# Altium schematic sheet MCU.SchDoc
size 355 x 203 mm; SheetNumber: 2; SheetTotal: 8
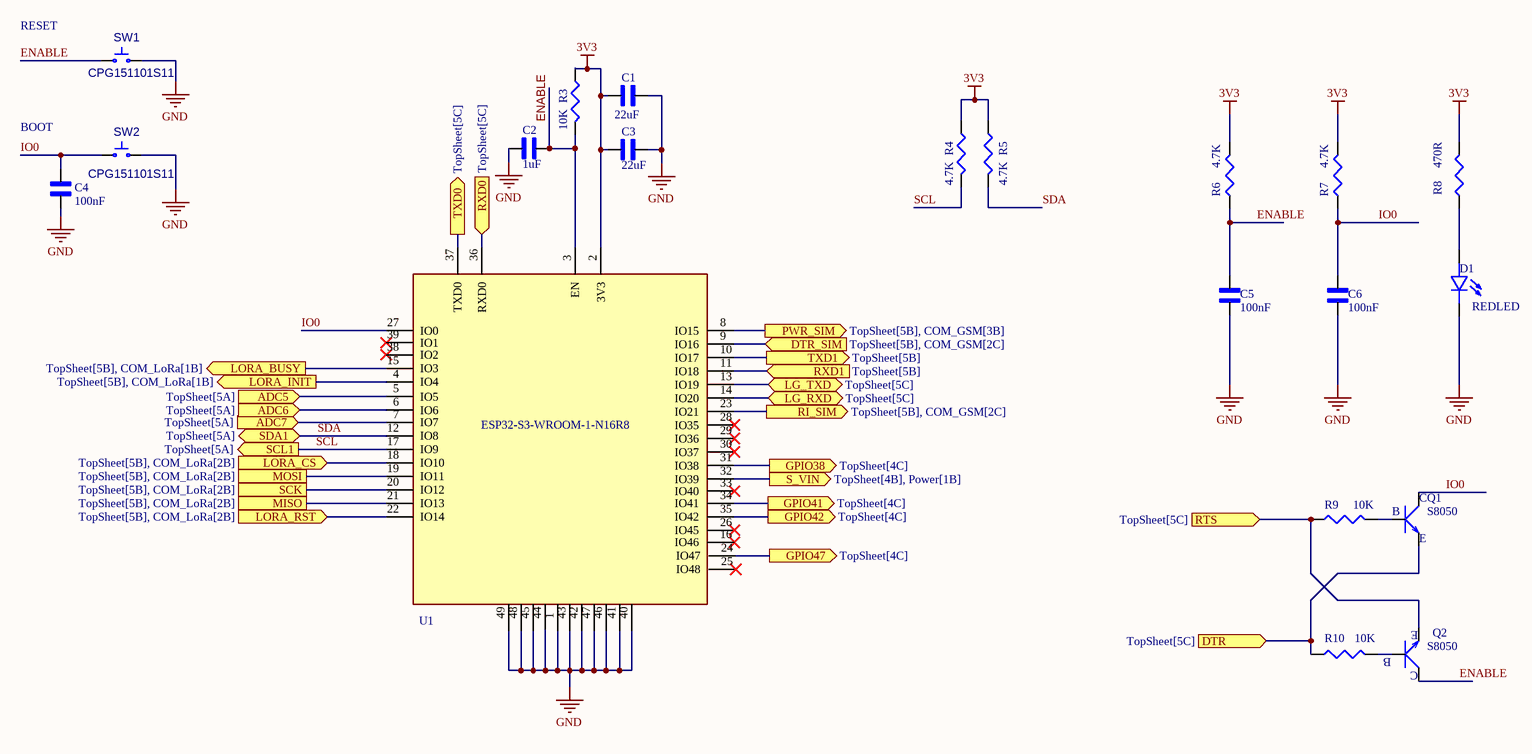
[diagram p0: MCU.SchDoc]

## Parts
C1  22uF  [C0603]
C2  1uF  [C0603]
C3  22uF  [C0603]
C4  100nF  [C0603]
C5  100nF  [C0603]
C6  100nF  [C0603]
D1  REDLED  [0603D-B]
Q1  S8050  [SOT95P237X112-3N]
Q2  S8050  [SOT95P237X112-3N]
R3  10K  [R0603]
R4  4.7K  [R0603]
R5  4.7K  [R0603]
R6  4.7K  [R0603]
R7  4.7K  [R0603]
R8  470R  [R0603]
R9  10K  [R0603]
R10  10K  [R0603]
SW1  CPG151101S11  [5.2 mm × 5.2 mm SW]
SW2  CPG151101S11  [5.2 mm × 5.2 mm SW]
U1  ESP32-S3-WROOM-1-N16R8  [ESP32S3WROOM1N8R2]

## Ports
ADC5 (in, see TopSheet[5A]), ADC6 (in, see TopSheet[5A]), ADC7 (in, see TopSheet[5A]), DTR (in, see TopSheet[5C]), DTR_SIM (in, see TopSheet[5B], COM_GSM[2C]), GPIO38 (out, see TopSheet[4C]), GPIO41 (out, see TopSheet[4C]), GPIO42 (out, see TopSheet[4C]), GPIO47 (out, see TopSheet[4C]), LG_RXD (bidir, see TopSheet[5C]), LG_TXD (bidir, see TopSheet[5C]), LORA_BUSY (out, see TopSheet[5B], COM_LoRa[1B]), LORA_CS (in, see TopSheet[5B], COM_LoRa[2B]), LORA_INIT (out, see TopSheet[5B], COM_LoRa[1B]), LORA_RST (in, see TopSheet[5B], COM_LoRa[2B]), MISO (see TopSheet[5B], COM_LoRa[2B]), MOSI (see TopSheet[5B], COM_LoRa[2B]), PWR_SIM (out, see TopSheet[5B], COM_GSM[3B]), RI_SIM (out, see TopSheet[5B], COM_GSM[2C]), RTS (in, see TopSheet[5C]), RXD0 (in, see TopSheet[5C]), RXD1 (in, see TopSheet[5B]), S_VIN (out, see TopSheet[4B], Power[1B]), SCK (see TopSheet[5B], COM_LoRa[2B]), SCL1 (out, see TopSheet[5A]), SDA1 (bidir, see TopSheet[5A]), TXD0 (out, see TopSheet[5C]), TXD1 (out, see TopSheet[5B])

## Nets
3V3: C1.1 C3.1 R3.1 R4.1 R5.1 R6.2 R7.2 R8.2 U1.2(3V3)
GND: C1.2 C2.1 C3.2 C4.1 C5.2 C6.2 D1.2(NEG) SW1.2 SW2.2
ADC5: U1.5(IO5) ; port ADC5
ADC6: U1.6(IO6) ; port ADC6
ADC7: U1.7(IO7) ; port ADC7
DTR: Q1.2(E) R10.1 ; port DTR
DTR_SIM: U1.9(IO16) ; port DTR_SIM
ENABLE: C2.2 C5.1 Q2.3(C) R3.2 R6.1 SW1.1 U1.3(EN)
GPIO38: U1.31(IO38) ; port GPIO38
GPIO41: U1.34(IO41) ; port GPIO41
GPIO42: U1.35(IO42) ; port GPIO42
GPIO47: U1.24(IO47) ; port GPIO47
IO0: C4.2 C6.1 Q1.3(C) R7.1 SW2.1 U1.27(IO0)
LG_RXD: U1.14(IO20) ; port LG_RXD
LG_TXD: U1.13(IO19) ; port LG_TXD
LORA_BUSY: U1.15(IO3) ; port LORA_BUSY
LORA_CS: U1.18(IO10) ; port LORA_CS
LORA_INIT: U1.4(IO4) ; port LORA_INIT
LORA_RST: U1.22(IO14) ; port LORA_RST
MISO: U1.21(IO13) ; port MISO
MOSI: U1.19(IO11) ; port MOSI
PWR_SIM: U1.8(IO15) ; port PWR_SIM
RI_SIM: U1.23(IO21) ; port RI_SIM
RTS: Q2.2(E) R9.1 ; port RTS
RXD0: U1.36(RXD0) ; port RXD0
RXD1: U1.11(IO18) ; port RXD1
S_VIN: U1.32(IO39) ; port S_VIN
SCK: U1.20(IO12) ; port SCK
SCL: R4.2 U1.17(IO9) ; port SCL1
SDA: R5.2 U1.12(IO8) ; port SDA1
TXD0: U1.37(TXD0) ; port TXD0
TXD1: U1.10(IO17) ; port TXD1
NetD1_1: D1.1(POS) R8.1
NetQ1_1: Q1.1(B) R9.2
NetQ2_1: Q2.1(B) R10.2

Not connected (* = marked no-connect by the designer): U1 1(GND) 16(IO46)* 25(IO48)* 26(IO45)* 28(IO35)* 29(IO36)* 30(IO37)* 33(IO40)* 38(IO2)* 39(IO1)* 40(GND) 41(GND) 42(GND) 43(GND) 44(GND) 45(GND) 46(GND) 47(GND) 48(GND) 49(GND)

## Notes on the sheet
- RESET
- BOOT

## Library data of the parts
C1-C6 = Capacitor non polar: This Non-Polarized Capacitor Design Library provides accurate schematic symbols and IPC-compliant PCB footprints for standard non-polarized capacitors, including MLCCs (ceramic capacitors) in common SMD sizes like 0402, 0603, 0805,1206 and 1210.; MF: Murata; MP: GJM1555C1HR10BB01J; SnapEDA_Link: https://www.snapeda.com/parts/GJM1555C1HR10BB01J/Murata/view-part/?ref=snap; Package: 1005 Taiyo Yuden; Check_prices: https://www.snapeda.com/parts/GJM1555C1HR10BB01J/Murata/view-part/?ref=eda
  C1 C3: VALUE: 22uF
  C2: VALUE: 1uF
  C4-C6: VALUE: 100nF
D1 = LED: Generic LED SMD; MF: Osram; MP: LHN974 RED LED 1206; SnapEDA_Link: https://www.snapeda.com/parts/LHN974%20RED%20LED%201206/Osram/view-part/?ref=snap; Package: None; Value: *; Check_prices: https://www.snapeda.com/parts/LHN974%20RED%20LED%201206/Osram/view-part/?ref=eda
Q1 Q2 = S8050: Bipolar (BJT) Transistor NPN 25 V 500 mA 150MHz 300 mW Surface Mount SOT-23; MF: UMW; Purchase-URL: https://pricing.snapeda.com/search/part/S8050/?ref=eda; Check_prices: https://www.snapeda.com/parts/S8050/Umwelt+Sensor+Teknik/view-part/?ref=eda; SnapEDA_Link: https://www.snapeda.com/parts/S8050/Umwelt+Sensor+Teknik/view-part/?ref=snap; Price: None; Availability: In Stock; Package: None; MP: S8050; Value: *
R3-R10 = Resistor: This Library provides a comprehensive set of schematic symbols and PCB footprints for standard resistor packages (e.g., 0402, 0603, 0805, 1206).
SW1 SW2 = Switch: Manufacturer Part Number: CPG151101S11; Supplier 3: LCSC; Supplier Part Number 3: C41430893
U1 = ESP32-S3-WROOM-1-N16R8: Bluetooth, WiFi 802.11b/g/n, Bluetooth v5.0 Transceiver Module 2.4GHz PCB Trace Surface Mount